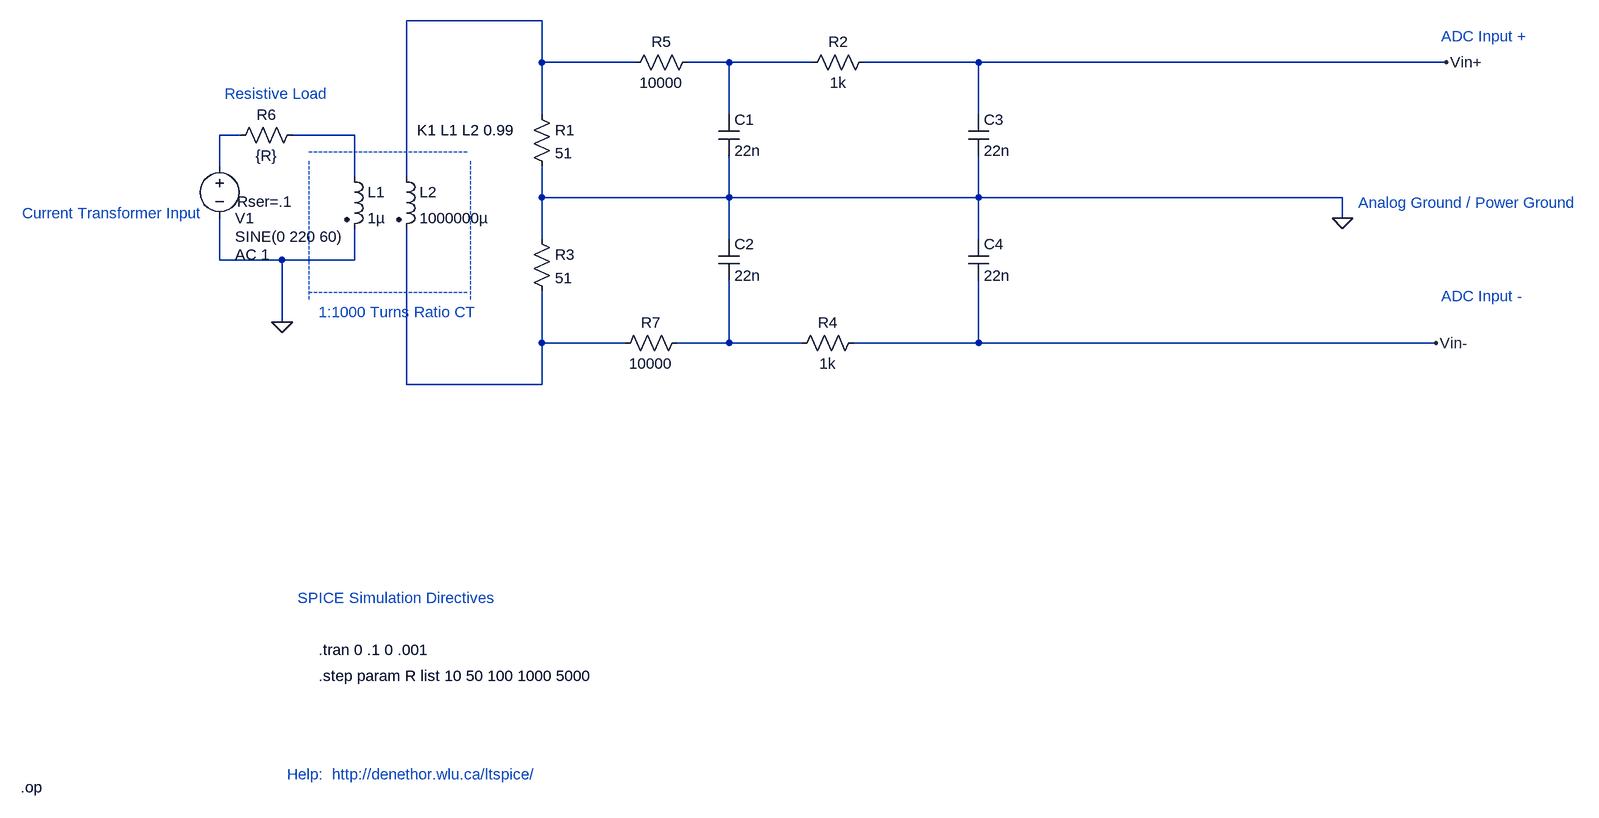
[diagram p0: schematic 3phasemeter_current.asc]
3phasemeter_current.asc, the LTspice schematic file:
Version 4
SHEET 1 1356 1016
WIRE -960 -304 -1168 -304
WIRE -960 -240 -960 -304
WIRE -816 -240 -960 -240
WIRE -672 -240 -736 -240
WIRE -544 -240 -672 -240
WIRE -288 -240 -464 -240
WIRE 432 -240 -288 -240
WIRE -960 -160 -960 -240
WIRE -672 -160 -672 -240
WIRE -288 -160 -288 -240
WIRE -1424 -128 -1456 -128
WIRE -1248 -128 -1344 -128
WIRE -1456 -80 -1456 -128
WIRE -1248 -64 -1248 -128
WIRE -1168 -64 -1168 -304
WIRE -960 -32 -960 -80
WIRE -672 -32 -672 -96
WIRE -672 -32 -960 -32
WIRE -288 -32 -288 -96
WIRE -288 -32 -672 -32
WIRE 272 -32 -288 -32
WIRE 272 0 272 -32
WIRE -960 32 -960 -32
WIRE -672 32 -672 -32
WIRE -288 32 -288 -32
WIRE -1456 64 -1456 0
WIRE -1360 64 -1456 64
WIRE -1248 64 -1248 16
WIRE -1248 64 -1360 64
WIRE -1360 160 -1360 64
WIRE -960 192 -960 112
WIRE -832 192 -960 192
WIRE -672 192 -672 96
WIRE -672 192 -752 192
WIRE -560 192 -672 192
WIRE -288 192 -288 96
WIRE -288 192 -480 192
WIRE 416 192 -288 192
WIRE -1168 256 -1168 16
WIRE -960 256 -960 192
WIRE -960 256 -1168 256
FLAG 272 0 0
FLAG 432 -240 Vin+
FLAG 416 192 Vin-
FLAG -1360 160 0
SYMBOL voltage -1456 -96 R0
WINDOW 0 24 96 Left 2
WINDOW 3 24 124 Left 2
WINDOW 39 27 70 Left 2
WINDOW 123 24 152 Left 2
SYMATTR InstName V1
SYMATTR Value SINE(0 220 60)
SYMATTR SpiceLine Rser=.1
SYMATTR Value2 AC 1
SYMBOL res -976 -176 R0
SYMATTR InstName R1
SYMATTR Value 51
SYMBOL res -976 16 R0
SYMATTR InstName R3
SYMATTR Value 51
SYMBOL res -720 -256 R90
WINDOW 0 0 56 VBottom 2
WINDOW 3 32 56 VTop 2
SYMATTR InstName R5
SYMATTR Value 10000
SYMBOL res -736 176 R90
WINDOW 0 0 56 VBottom 2
WINDOW 3 32 56 VTop 2
SYMATTR InstName R7
SYMATTR Value 10000
SYMBOL cap -688 -160 R0
SYMATTR InstName C1
SYMATTR Value 22n
SYMBOL cap -688 32 R0
SYMATTR InstName C2
SYMATTR Value 22n
SYMBOL res -448 -256 R90
WINDOW 0 0 56 VBottom 2
WINDOW 3 32 56 VTop 2
SYMATTR InstName R2
SYMATTR Value 1k
SYMBOL res -464 176 R90
WINDOW 0 0 56 VBottom 2
WINDOW 3 32 56 VTop 2
SYMATTR InstName R4
SYMATTR Value 1k
SYMBOL cap -304 -160 R0
SYMATTR InstName C3
SYMATTR Value 22n
SYMBOL cap -304 32 R0
SYMATTR InstName C4
SYMATTR Value 22n
SYMBOL ind2 -1264 -80 R0
SYMATTR InstName L1
SYMATTR Value 1µ
SYMATTR Type ind
SYMBOL ind2 -1184 -80 R0
SYMATTR InstName L2
SYMATTR Value 1000000µ
SYMATTR Type ind
SYMATTR SpiceLine Rser=50
SYMBOL res -1328 -144 R90
WINDOW 0 0 56 VBottom 2
WINDOW 3 32 56 VTop 2
SYMATTR InstName R6
SYMATTR Value {R}
TEXT -1352 856 Left 2 ;Help:  http://denethor.wlu.ca/ltspice/
TEXT -1336 584 Left 2 ;SPICE Simulation Directives
TEXT 296 -24 Left 2 ;Analog Ground / Power Ground
TEXT 424 -280 Left 2 ;ADC Input +
TEXT 424 120 Left 2 ;ADC Input -
TEXT -1760 -8 Left 2 ;Current Transformer Input
TEXT -1304 704 Left 2 !.step param R list 10 50 100 1000 5000
TEXT -1152 -136 Left 2 !K1 L1 L2 0.99
TEXT -1320 -104 Left 2 ;--------------------------------
TEXT -1320 112 Left 2 ;--------------------------------
TEXT -1072 -104 VRight 2 ;----------------------------
TEXT -1320 -104 VRight 2 ;----------------------------
TEXT -1304 144 Left 2 ;1:1000 Turns Ratio CT
TEXT -1448 -192 Left 2 ;Resistive Load
TEXT -1762 876 Left 2 !.op
TEXT -1304 664 Left 2 !.tran 0 .1 0 .001

The netlist it stands for:
* 3phasemeter_current.asc
V1 N003 0 SINE(0 220 60) AC 1 Rser=.1
R1 N001 0 51
R3 0 N005 51
R5 N002 N001 10000
R7 N006 N005 10000
C1 N002 0 22n
C2 0 N006 22n
R2 Vin+ N002 1k
R4 Vin- N006 1k
C3 Vin+ 0 22n
C4 0 Vin- 22n
L1 N004 0 1µ
L2 N001 N005 1000000µ Rser=50
R6 N004 N003 {R}
* Help:  http://denethor.wlu.ca/ltspice/
* SPICE Simulation Directives
* Analog Ground / Power Ground
* ADC Input +
* ADC Input -
* Current Transformer Input
.step param R list 10 50 100 1000 5000
K1 L1 L2 0.99
* --------------------------------
* --------------------------------
* ----------------------------
* ----------------------------
* 1:1000 Turns Ratio CT
* Resistive Load
.op
.tran 0 .1 0 .001
.backanno
.end